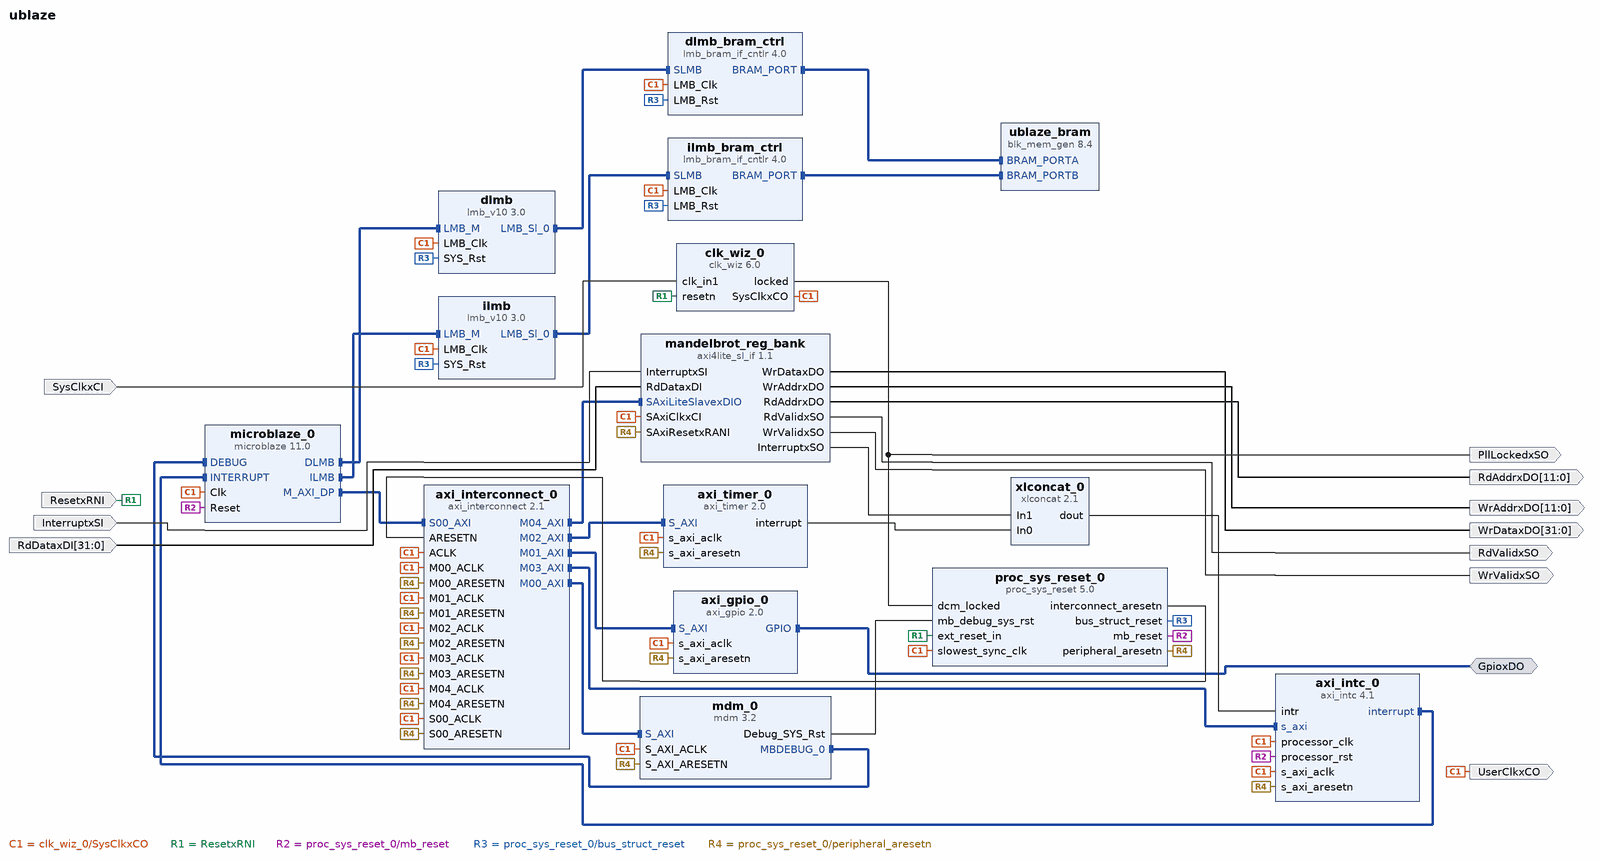
[diagram p0: block diagram of the top level]
# Vivado block design ublaze, xc7a200tsbg484-1, Vivado 2018.3
create_bd_design ublaze

create_bd_intf_port -mode Master -vlnv xilinx.com:interface:gpio_rtl:1.0 GpioxDO
create_bd_port -dir O -type clk UserClkxCO
create_bd_port -dir I -type clk SysClkxCI
set_property -dict {CONFIG.ASSOCIATED_RESET ResetxRNI} [get_bd_ports SysClkxCI]
create_bd_port -dir I -type rst ResetxRNI
create_bd_port -dir O PllLockedxSO
create_bd_port -dir O -from 31 -to 0 WrDataxDO
create_bd_port -dir O -from 11 -to 0 WrAddrxDO
create_bd_port -dir O WrValidxSO
create_bd_port -dir O -from 11 -to 0 RdAddrxDO
create_bd_port -dir O RdValidxSO
create_bd_port -dir I -type intr InterruptxSI
create_bd_port -dir I -from 31 -to 0 RdDataxDI

create_bd_cell -type ip -vlnv xilinx.com:ip:lmb_v10:3.0 ilmb
create_bd_cell -type ip -vlnv xilinx.com:ip:lmb_v10:3.0 dlmb
create_bd_cell -type ip -vlnv xilinx.com:ip:lmb_bram_if_cntlr:4.0 ilmb_bram_ctrl
create_bd_cell -type ip -vlnv xilinx.com:ip:lmb_bram_if_cntlr:4.0 dlmb_bram_ctrl
create_bd_cell -type ip -vlnv xilinx.com:ip:xlconcat:2.1 xlconcat_0
set_property -dict {CONFIG.NUM_PORTS 2} [get_bd_cells xlconcat_0]
create_bd_cell -type ip -vlnv xilinx.com:ip:axi_gpio:2.0 axi_gpio_0
set_property -dict {CONFIG.C_ALL_OUTPUTS 1 CONFIG.C_GPIO_WIDTH 8} [get_bd_cells axi_gpio_0]
create_bd_cell -type ip -vlnv xilinx.com:ip:axi_intc:4.1 axi_intc_0
set_property -dict {CONFIG.C_HAS_FAST 1} [get_bd_cells axi_intc_0]
create_bd_cell -type ip -vlnv xilinx.com:ip:axi_interconnect:2.1 axi_interconnect_0
set_property -dict {CONFIG.NUM_MI 5} [get_bd_cells axi_interconnect_0]
create_bd_cell -type ip -vlnv xilinx.com:ip:axi_timer:2.0 axi_timer_0
set_property -dict {CONFIG.enable_timer2 0} [get_bd_cells axi_timer_0]
create_bd_cell -type ip -vlnv xilinx.com:ip:blk_mem_gen:8.4 ublaze_bram
set_property -dict [list \
  CONFIG.EN_SAFETY_CKT false \
  CONFIG.Enable_B Use_ENB_Pin \
  CONFIG.Memory_Type True_Dual_Port_RAM \
  CONFIG.Port_B_Clock 100 \
  CONFIG.Port_B_Enable_Rate 100 \
  CONFIG.Port_B_Write_Rate 50 \
  CONFIG.Use_RSTB_Pin true \
] [get_bd_cells ublaze_bram]
create_bd_cell -type ip -vlnv xilinx.com:ip:clk_wiz:6.0 clk_wiz_0
set_property -dict [list \
  CONFIG.CLKIN2_JITTER_PS 166.66 \
  CONFIG.CLKOUT1_JITTER 151.636 \
  CONFIG.CLKOUT1_REQUESTED_OUT_FREQ 50 \
  CONFIG.CLK_OUT1_PORT SysClkxCO \
  CONFIG.MMCM_CLKIN2_PERIOD 10.000 \
  CONFIG.MMCM_CLKOUT0_DIVIDE_F 20.000 \
  CONFIG.MMCM_DIVCLK_DIVIDE 1 \
  CONFIG.RESET_PORT resetn \
  CONFIG.RESET_TYPE ACTIVE_LOW \
  CONFIG.SECONDARY_SOURCE Single_ended_clock_capable_pin \
  CONFIG.USE_INCLK_SWITCHOVER false \
] [get_bd_cells clk_wiz_0]
create_bd_cell -type ip -vlnv xilinx.com:ip:mdm:3.2 mdm_0
set_property -dict {CONFIG.C_USE_UART 1} [get_bd_cells mdm_0]
create_bd_cell -type ip -vlnv xilinx.com:ip:microblaze:11.0 microblaze_0
set_property -dict [list \
  CONFIG.C_ADDR_TAG_BITS 0 \
  CONFIG.C_AREA_OPTIMIZED 0 \
  CONFIG.C_DCACHE_ADDR_TAG 0 \
  CONFIG.C_D_AXI 1 \
  CONFIG.C_ILL_OPCODE_EXCEPTION 0 \
  CONFIG.C_M_AXI_D_BUS_EXCEPTION 0 \
  CONFIG.C_NUMBER_OF_PC_BRK 1 \
  CONFIG.C_NUMBER_OF_RD_ADDR_BRK 0 \
  CONFIG.C_NUMBER_OF_WR_ADDR_BRK 0 \
  CONFIG.C_PVR 0 \
  CONFIG.C_UNALIGNED_EXCEPTIONS 0 \
  CONFIG.C_USE_BARREL 0 \
  CONFIG.C_USE_BRANCH_TARGET_CACHE 0 \
  CONFIG.C_USE_DCACHE 0 \
  CONFIG.C_USE_DIV 0 \
  CONFIG.C_USE_FPU 0 \
  CONFIG.C_USE_HW_MUL 0 \
  CONFIG.C_USE_ICACHE 0 \
  CONFIG.C_USE_MMU 0 \
  CONFIG.C_USE_MSR_INSTR 0 \
  CONFIG.C_USE_PCMP_INSTR 0 \
  CONFIG.C_USE_REORDER_INSTR 1 \
  CONFIG.G_TEMPLATE_LIST 0 \
  CONFIG.G_USE_EXCEPTIONS 0 \
] [get_bd_cells microblaze_0]
create_bd_cell -type ip -vlnv xilinx.com:ip:proc_sys_reset:5.0 proc_sys_reset_0
create_bd_cell -type ip -vlnv hepia.hesge.ch:user:axi4lite_sl_if:1.1 mandelbrot_reg_bank

# ---- connections ----

connect_bd_intf_net [get_bd_intf_pins microblaze_0/ILMB] [get_bd_intf_pins ilmb/LMB_M]
connect_bd_intf_net [get_bd_intf_ports GpioxDO] [get_bd_intf_pins axi_gpio_0/GPIO]
connect_bd_intf_net [get_bd_intf_pins microblaze_0/M_AXI_DP] [get_bd_intf_pins axi_interconnect_0/S00_AXI]
connect_bd_intf_net [get_bd_intf_pins dlmb/LMB_Sl_0] [get_bd_intf_pins dlmb_bram_ctrl/SLMB]
connect_bd_intf_net [get_bd_intf_pins microblaze_0/DLMB] [get_bd_intf_pins dlmb/LMB_M]
connect_bd_intf_net [get_bd_intf_pins mandelbrot_reg_bank/SAxiLiteSlavexDIO] [get_bd_intf_pins axi_interconnect_0/M04_AXI]
connect_bd_intf_net [get_bd_intf_pins axi_interconnect_0/M03_AXI] [get_bd_intf_pins axi_intc_0/s_axi]
connect_bd_intf_net [get_bd_intf_pins dlmb_bram_ctrl/BRAM_PORT] [get_bd_intf_pins ublaze_bram/BRAM_PORTA]
connect_bd_intf_net [get_bd_intf_pins axi_gpio_0/S_AXI] [get_bd_intf_pins axi_interconnect_0/M01_AXI]
connect_bd_intf_net [get_bd_intf_pins axi_timer_0/S_AXI] [get_bd_intf_pins axi_interconnect_0/M02_AXI]
connect_bd_intf_net [get_bd_intf_pins mdm_0/MBDEBUG_0] [get_bd_intf_pins microblaze_0/DEBUG]
connect_bd_intf_net [get_bd_intf_pins ilmb_bram_ctrl/BRAM_PORT] [get_bd_intf_pins ublaze_bram/BRAM_PORTB]
connect_bd_intf_net [get_bd_intf_pins axi_interconnect_0/M00_AXI] [get_bd_intf_pins mdm_0/S_AXI]
connect_bd_intf_net [get_bd_intf_pins axi_intc_0/interrupt] [get_bd_intf_pins microblaze_0/INTERRUPT]
connect_bd_intf_net [get_bd_intf_pins ilmb/LMB_Sl_0] [get_bd_intf_pins ilmb_bram_ctrl/SLMB]
connect_bd_net [get_bd_pins clk_wiz_0/SysClkxCO] \
  [get_bd_ports UserClkxCO] [get_bd_pins ilmb/LMB_Clk] [get_bd_pins dlmb/LMB_Clk] [get_bd_pins ilmb_bram_ctrl/LMB_Clk] \
  [get_bd_pins dlmb_bram_ctrl/LMB_Clk] [get_bd_pins axi_gpio_0/s_axi_aclk] [get_bd_pins axi_intc_0/s_axi_aclk] \
  [get_bd_pins axi_intc_0/processor_clk] [get_bd_pins axi_interconnect_0/ACLK] [get_bd_pins axi_interconnect_0/S00_ACLK] \
  [get_bd_pins axi_interconnect_0/M00_ACLK] [get_bd_pins axi_interconnect_0/M01_ACLK] \
  [get_bd_pins axi_interconnect_0/M02_ACLK] [get_bd_pins axi_interconnect_0/M03_ACLK] \
  [get_bd_pins axi_interconnect_0/M04_ACLK] [get_bd_pins axi_timer_0/s_axi_aclk] [get_bd_pins mdm_0/S_AXI_ACLK] \
  [get_bd_pins microblaze_0/Clk] [get_bd_pins proc_sys_reset_0/slowest_sync_clk] [get_bd_pins mandelbrot_reg_bank/SAxiClkxCI]
connect_bd_net -net clk_in1_0_1 [get_bd_ports SysClkxCI] [get_bd_pins clk_wiz_0/clk_in1]
connect_bd_net -net resetn_0_1 [get_bd_ports ResetxRNI] [get_bd_pins clk_wiz_0/resetn] [get_bd_pins proc_sys_reset_0/ext_reset_in]
connect_bd_net [get_bd_pins proc_sys_reset_0/mb_reset] [get_bd_pins axi_intc_0/processor_rst] [get_bd_pins microblaze_0/Reset]
connect_bd_net [get_bd_pins clk_wiz_0/locked] [get_bd_ports PllLockedxSO] [get_bd_pins proc_sys_reset_0/dcm_locked]
connect_bd_net [get_bd_pins proc_sys_reset_0/bus_struct_reset] \
  [get_bd_pins ilmb/SYS_Rst] [get_bd_pins dlmb/SYS_Rst] [get_bd_pins ilmb_bram_ctrl/LMB_Rst] \
  [get_bd_pins dlmb_bram_ctrl/LMB_Rst]
connect_bd_net -net ARESETN_1 [get_bd_pins proc_sys_reset_0/interconnect_aresetn] [get_bd_pins axi_interconnect_0/ARESETN]
connect_bd_net -net S00_ARESETN_1 [get_bd_pins proc_sys_reset_0/peripheral_aresetn] \
  [get_bd_pins axi_gpio_0/s_axi_aresetn] [get_bd_pins axi_intc_0/s_axi_aresetn] [get_bd_pins axi_interconnect_0/S00_ARESETN] \
  [get_bd_pins axi_interconnect_0/M00_ARESETN] [get_bd_pins axi_interconnect_0/M01_ARESETN] \
  [get_bd_pins axi_interconnect_0/M02_ARESETN] [get_bd_pins axi_interconnect_0/M03_ARESETN] \
  [get_bd_pins axi_interconnect_0/M04_ARESETN] [get_bd_pins axi_timer_0/s_axi_aresetn] [get_bd_pins mdm_0/S_AXI_ARESETN] \
  [get_bd_pins mandelbrot_reg_bank/SAxiResetxRANI]
connect_bd_net [get_bd_pins mdm_0/Debug_SYS_Rst] [get_bd_pins proc_sys_reset_0/mb_debug_sys_rst]
connect_bd_net [get_bd_pins axi_timer_0/interrupt] [get_bd_pins xlconcat_0/In0]
connect_bd_net [get_bd_pins xlconcat_0/dout] [get_bd_pins axi_intc_0/intr]
connect_bd_net -net axi4lite_sl_if_0_WrDataxDO [get_bd_pins mandelbrot_reg_bank/WrDataxDO] [get_bd_ports WrDataxDO]
connect_bd_net -net axi4lite_sl_if_0_WrAddrxDO [get_bd_pins mandelbrot_reg_bank/WrAddrxDO] [get_bd_ports WrAddrxDO]
connect_bd_net -net axi4lite_sl_if_0_WrValidxSO [get_bd_pins mandelbrot_reg_bank/WrValidxSO] [get_bd_ports WrValidxSO]
connect_bd_net -net axi4lite_sl_if_0_RdAddrxDO [get_bd_pins mandelbrot_reg_bank/RdAddrxDO] [get_bd_ports RdAddrxDO]
connect_bd_net -net axi4lite_sl_if_0_RdValidxSO [get_bd_pins mandelbrot_reg_bank/RdValidxSO] [get_bd_ports RdValidxSO]
connect_bd_net [get_bd_ports InterruptxSI] [get_bd_pins mandelbrot_reg_bank/InterruptxSI]
connect_bd_net [get_bd_ports RdDataxDI] [get_bd_pins mandelbrot_reg_bank/RdDataxDI]
connect_bd_net -net axi4lite_sl_if_0_InterruptxSO [get_bd_pins mandelbrot_reg_bank/InterruptxSO] [get_bd_pins xlconcat_0/In1]
set_property HDL_ATTRIBUTE.BMM_INFO_ADDRESS_SPACE {byte  0x00000000 32 > ublaze ublaze_bram} [get_bd_cells dlmb_bram_ctrl]
set_property HDL_ATTRIBUTE.KEEP_HIERARCHY yes [get_bd_cells dlmb_bram_ctrl]
set_property HDL_ATTRIBUTE.BMM_INFO_PROCESSOR {microblaze-le > ublaze dlmb_bram_ctrl} [get_bd_cells microblaze_0]
set_property HDL_ATTRIBUTE.KEEP_HIERARCHY yes [get_bd_cells microblaze_0]

# ---- address map ----
assign_bd_address -offset 0x00000000 -range 32K -target_address_space [get_bd_addr_spaces microblaze_0/Data] [get_bd_addr_segs dlmb_bram_ctrl/SLMB/Mem]
assign_bd_address -offset 0x40000000 -range 64K -target_address_space [get_bd_addr_spaces microblaze_0/Data] [get_bd_addr_segs axi_gpio_0/S_AXI/Reg]
assign_bd_address -offset 0x41200000 -range 64K -target_address_space [get_bd_addr_spaces microblaze_0/Data] [get_bd_addr_segs axi_intc_0/S_AXI/Reg]
assign_bd_address -offset 0x41400000 -range 4K -target_address_space [get_bd_addr_spaces microblaze_0/Data] [get_bd_addr_segs mdm_0/S_AXI/Reg]
assign_bd_address -offset 0x41C00000 -range 64K -target_address_space [get_bd_addr_spaces microblaze_0/Data] [get_bd_addr_segs axi_timer_0/S_AXI/Reg]
assign_bd_address -offset 0x44A00000 -range 4K -target_address_space [get_bd_addr_spaces microblaze_0/Data] [get_bd_addr_segs mandelbrot_reg_bank/SAxiLiteSlavexDIO/Reg]
assign_bd_address -offset 0x00000000 -range 32K -target_address_space [get_bd_addr_spaces microblaze_0/Instruction] [get_bd_addr_segs ilmb_bram_ctrl/SLMB/Mem]

validate_bd_design
save_bd_design
